# Altium schematic sheet onStep-board-power.SchDoc
size A4
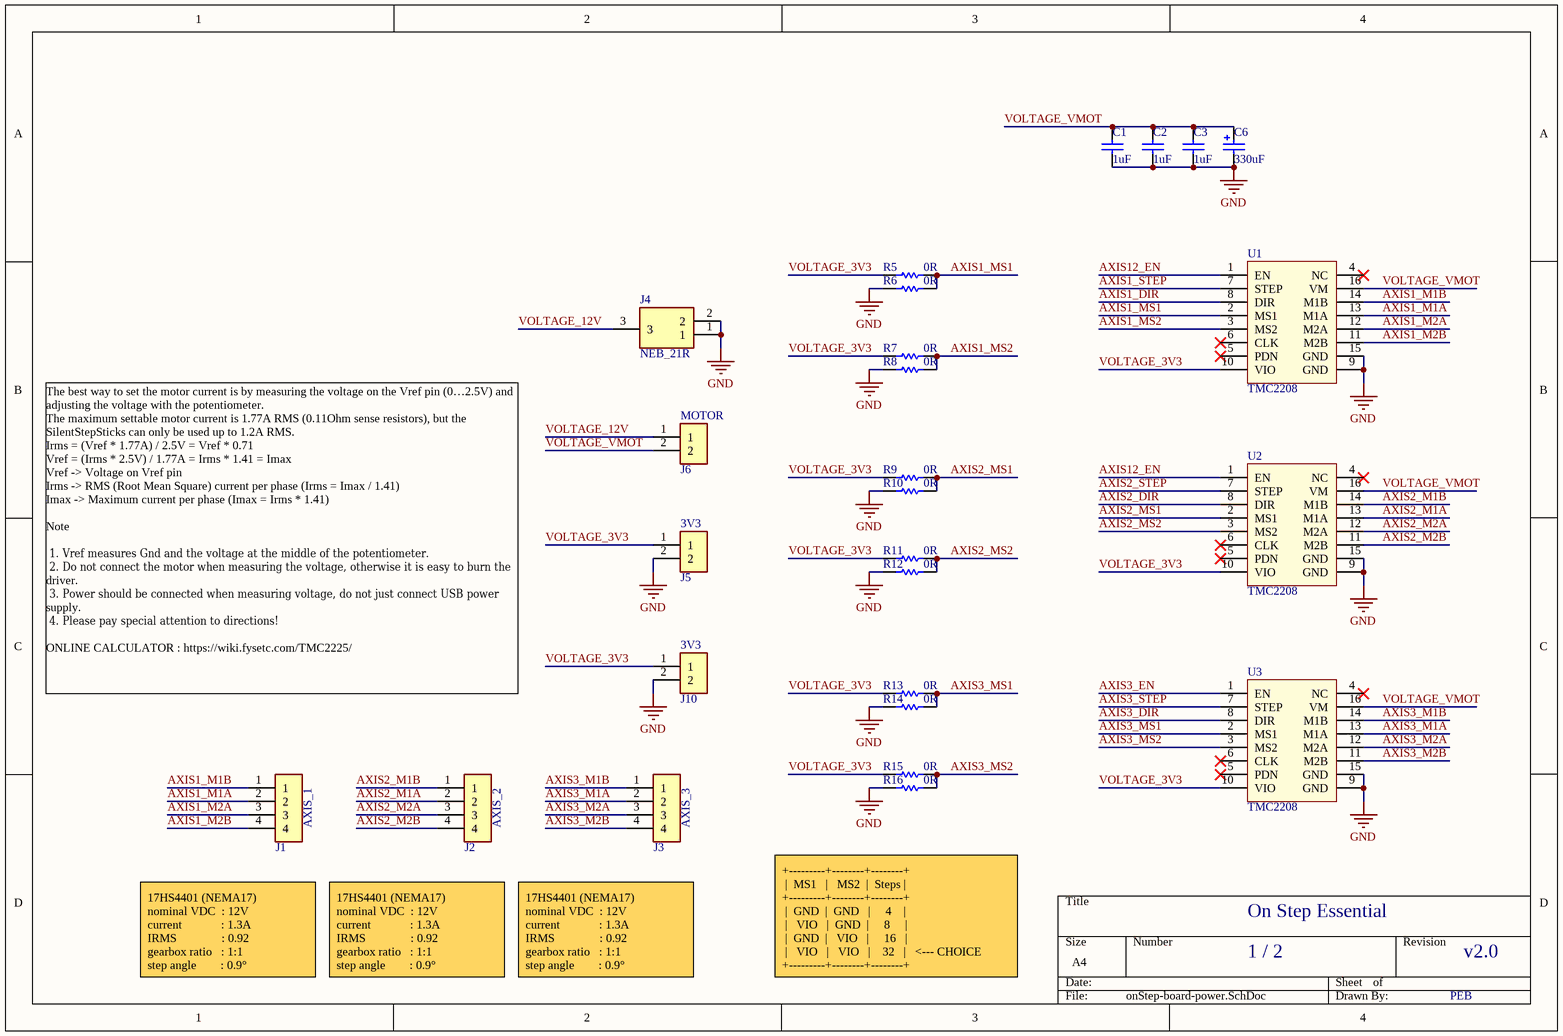
[diagram p0: onStep-board-power.SchDoc]

## Parts
C1  value 1uF  [0805]  (hidden comment: Cap)
C2  value 1uF  [0805]  (hidden comment: Cap)
C3  value 1uF  [0805]  (hidden comment: Cap)
C6  value 330uF  [WCAP-ASLL_8x10.5]  (hidden comment: 865060453008)
J1  AXIS_1  [B4BXHALFSN]
J2  AXIS_2  [B4BXHALFSN]
J3  AXIS_3  [B4BXHALFSN]
J4  NEB_21R  [NEB21R]
J5  3V3  [B2BXHALFSN]
J6  MOTOR  [B2BXHALFSN]
J10  3V3  [B2BXHALFSN]
R5  value 0R  [0805]  (hidden comment: Res1)
R6  value 0R  [0805]  (hidden comment: Res1)
R7  value 0R  [0805]  (hidden comment: Res1)
R8  value 0R  [0805]  (hidden comment: Res1)
R9  value 0R  [0805]  (hidden comment: Res1)
R10  value 0R  [0805]  (hidden comment: Res1)
R11  value 0R  [0805]  (hidden comment: Res1)
R12  value 0R  [0805]  (hidden comment: Res1)
R13  value 0R  [0805]  (hidden comment: Res1)
R14  value 0R  [0805]  (hidden comment: Res1)
R15  value 0R  [0805]  (hidden comment: Res1)
R16  value 0R  [0805]  (hidden comment: Res1)
U1  TMC2208  [TMC22xx]
U2  TMC2208  [TMC22xx]
U3  TMC2208  [TMC22xx]

## Nets
GND: C1.1 C2.1 C3.1 C6.2(N) J4.1 J4.2 J5.2 J10.2 R6.1 R8.1 R10.1 R12.1 R14.1 R16.1 U1.9(GND) U1.15(GND) U2.9(GND) U2.15(GND) U3.9(GND) U3.15(GND)
AXIS1_DIR: U1.8(DIR)
AXIS1_M1A: J1.2 U1.13(M1A)
AXIS1_M1B: J1.1 U1.14(M1B)
AXIS1_M2A: J1.3 U1.12(M2A)
AXIS1_M2B: J1.4 U1.11(M2B)
AXIS1_MS1: R5.2 R6.2 U1.2(MS1)
AXIS1_MS2: R7.2 R8.2 U1.3(MS2)
AXIS1_STEP: U1.7(STEP)
AXIS2_DIR: U2.8(DIR)
AXIS2_M1A: J2.2 U2.13(M1A)
AXIS2_M1B: J2.1 U2.14(M1B)
AXIS2_M2A: J2.3 U2.12(M2A)
AXIS2_M2B: J2.4 U2.11(M2B)
AXIS2_MS1: R9.2 R10.2 U2.2(MS1)
AXIS2_MS2: R11.2 R12.2 U2.3(MS2)
AXIS2_STEP: U2.7(STEP)
AXIS3_DIR: U3.8(DIR)
AXIS3_EN: U3.1(EN)
AXIS3_M1A: J3.2 U3.13(M1A)
AXIS3_M1B: J3.1 U3.14(M1B)
AXIS3_M2A: J3.3 U3.12(M2A)
AXIS3_M2B: J3.4 U3.11(M2B)
AXIS3_MS1: R13.2 R14.2 U3.2(MS1)
AXIS3_MS2: R15.2 R16.2 U3.3(MS2)
AXIS3_STEP: U3.7(STEP)
AXIS12_EN: U1.1(EN) U2.1(EN)
VOLTAGE_3V3: J5.1 J10.1 R5.1 R7.1 R9.1 R11.1 R13.1 R15.1 U1.10(VIO) U2.10(VIO) U3.10(VIO)
VOLTAGE_12V: J4.3 J6.1
VOLTAGE_VMOT: C1.2 C2.2 C3.2 C6.1(P) J6.2 U1.16(VM) U2.16(VM) U3.16(VM)

Not connected (* = marked no-connect by the designer): U1 4(NC)* 5(PDN)* 6(CLK)*; U2 4(NC)* 5(PDN)* 6(CLK)*; U3 4(NC)* 5(PDN)* 6(CLK)*

## Notes on the sheet
- The best way to set the motor current is by measuring the voltage on the Vref pin (0…2.5V) and adjusting the voltage with the potentiometer.
  The maximum settable motor current is 1.77A RMS (0.11Ohm sense resistors), but the SilentStepSticks can only be used up to 1.2A RMS.
  Irms = (Vref * 1.77A) / 2.5V = Vref * 0.71
  Vref = (Irms * 2.5V) / 1.77A = Irms * 1.41 = Imax
  Vref -> Voltage on Vref pin
  Irms -> RMS (Root Mean Square) current per phase (Irms = Imax / 1.41)
  Imax -> Maximum current per phase (Imax = Irms * 1.41)
  Note
  ​ 1. Vref measures Gnd and the voltage at the middle of the potentiometer.
  ​ 2. Do not connect the motor when measuring the voltage, otherwise it is easy to burn the driver.
  ​ 3. Power should be connected when measuring voltage, do not just connect USB power supply.
  ​ 4. Please pay special attention to directions!
  ONLINE CALCULATOR : https://wiki.fysetc.com/TMC2225/
- On Step Essential
- 17HS4401 (NEMA17)
  nominal VDC  : 12V
  current             : 1.3A
  IRMS               : 0.92
  gearbox ratio   : 1:1
  step angle        : 0.9°
- +---------+--------+--------+
  |  MS1   |   MS2  |  Steps |
  +---------+--------+--------+
  |  GND  |  GND   |     4    |
  |   VIO   |  GND  |     8     |
  |  GND  |   VIO   |     16   |
  |   VIO   |   VIO   |    32   |   <--- CHOICE
  +---------+--------+--------+
- 1 / 2
- v2.0
- PEB

## Library data of the parts
C1-C3 = Cap: Capacitor; Published: 8-Jun-2000; LatestRevisionDate: 17-Jul-2002; LatestRevisionNote: Re-released for DXP Platform.; PackageReference: RAD-0.3; Publisher: Altium Limited; PackageDescription: Radial Cap, Thru-Hole; 2 Leads; 0.3 in Pin Spacing
C6 = 865060453008: WCAP-ASLL Aluminum Electrolytic Capacitors, size Ф8x10.5mm, 25V DC, 330uF; Rated Voltage: 25V DC; ComponentLink1Description: Manufacturer; ComponentLink1URL: http://www.we-online.de; ComponentLink2Description: Datasheet; ComponentLink2URL: http://katalog.we-online.de/pbs/datasheet/865060453008.pdf; Part Number: 865060453008; Published Date: June 2017; Publisher: Wurth Elektronik; Size: Ф8x10.5mm; Life Cycle: 5000h; Operating Temperature: -55 °C up to +105 °C
J1-J3 = B4B-XH-A_LF__SN_: Connector; Manufacturer_Name: JST (JAPAN SOLDERLESS TERMINALS); Manufacturer_Part_Number: B4B-XH-A(LF)(SN); Datasheet Link: https://datasheet.lcsc.com/szlcsc/JST-Sales-America-B4B-XH-A-LF-SN_C144395.pdf; Height: 7mm; Arrow Part Number: B4B-XH-A(LF)(SN); Arrow Price/Stock: https://www.arrow.com/en/products/b4b-xh-a-lf-sn/jst-manufacturing
J4 = NEB_21R: Connector; Manufacturer_Name: LUMBERG; Manufacturer_Part_Number: NEB+21+R; Datasheet Link: https://downloads.lumberg.com/datenblaetter/en/neb21r.pdf; Height: 11mm
J5 J6 J10 = B2B-XH-A_LF__SN_: Connector; Manufacturer_Name: JST (JAPAN SOLDERLESS TERMINALS); Manufacturer_Part_Number: B2B-XH-A(LF)(SN); Datasheet Link: http://www.jst-mfg.com/product/pdf/eng/eXH.pdf; Height: 7mm; Arrow Part Number: B2B-XH-A(LF)(SN); Arrow Price/Stock: https://www.arrow.com/en/products/b2b-xh-a-lf-sn/jst-manufacturing?region=europe
R5-R16 = Res1: Resistor; Published: 8-Jun-2000; LatestRevisionDate: 17-Jul-2002; LatestRevisionNote: Re-released for DXP Platform.; PackageReference: AXIAL-0.3; Publisher: Altium Limited; PackageDescription: Axial Device, Thru-Hole; 2 Leads; 0.3 in Pin Spacing